# EAGLE schematic tirasRGB (EAGLE 6.5.0)
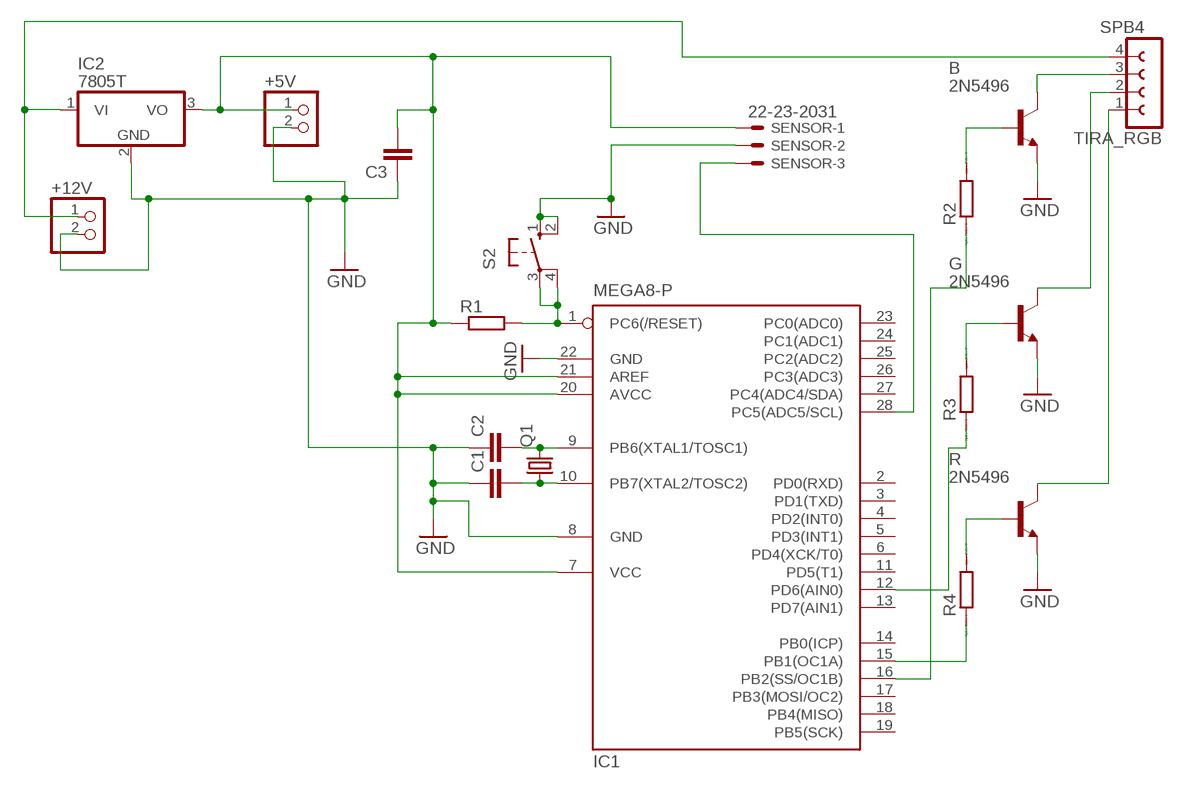
[diagram p0: schematic, sheet 1]

## Parts
+5V  PINHD-1X2  [1X02]
+12V  PINHD-1X2  [1X02]
B  2N5496  [TO220]
C1  C2,5-3  [C2.5-3]
C2  C2,5-3  [C2.5-3]
C3  C2,5-3  [C2.5-3]
G  2N5496  [TO220]
IC1  MEGA8-P  [DIL28-3]
IC2  7805T  [TO220H]
Q1  CRYSTALTC26V  [TC26V]
R  2N5496  [TO220]
R1  R-EU_0204/5  [0204/5]
R2  R0207/10  [0207/10]
R3  R0207/10  [0207/10]
R4  R0207/10  [0207/10]
S2  10-XX  [B3F-10XX]
SENSOR  22-23-2031  [22-23-2031]
TIRA_RGB  SPB4  [SPB4]

## Nets
3.3V: +5V.1 C3.2 IC1.7(VCC) IC1.20(AVCC) IC1.21(AREF) IC2.3(VO) R1.1 SENSOR.1
GND: +5V.2 +12V.2 B.3(E) C1.1 C2.1 C3.1 G.3(E) IC1.8(GND) IC1.22(GND) IC2.2(GND) R.3(E) S2.1(S) S2.2(S1) SENSOR.2
N$1: B.1(B) R2.2
N$2: +12V.1 IC2.1(VI) TIRA_RGB.4
N$3: G.1(B) R3.2
N$4: R4.2 R.1(B)
N$5: R.2(C) TIRA_RGB.1
N$6: G.2(C) TIRA_RGB.2
N$7: B.2(C) TIRA_RGB.3
N$8: IC1.15(PB1(OC1A)) R4.1
N$9: IC1.12(PD6(AIN0)) R3.1
N$10: IC1.16(PB2(SS/OC1B)) R2.1
N$12: IC1.28(PC5(ADC5/SCL)) SENSOR.3
N$14: C2.2 IC1.9(PB6(XTAL1/TOSC1)) Q1.2
N$15: C1.2 IC1.10(PB7(XTAL2/TOSC2)) Q1.1
N$16: IC1.1(PC6(/RESET)) R1.2 S2.3(P) S2.4(P1)
Unconnected: IC1.2(PD0(RXD)) IC1.3(PD1(TXD)) IC1.4(PD2(INT0)) IC1.5(PD3(INT1)) IC1.6(PD4(XCK/T0)) IC1.11(PD5(T1)) IC1.13(PD7(AIN1)) IC1.14(PB0(ICP)) IC1.17(PB3(MOSI/OC2)) IC1.18(PB4(MISO)) IC1.19(PB5(SCK)) IC1.23(PC0(ADC0)) IC1.24(PC1(ADC1)) IC1.25(PC2(ADC2)) IC1.26(PC3(ADC3)) IC1.27(PC4(ADC4/SDA))

## Library data of the parts
+5V +12V = pinhead:PINHD-1X2: PIN HEADER
B G R = transistor:2N5496: NPN TRANSISTOR
C1-C3 = capacitor-wima:C: CAPACITOR naming: grid - package width
IC1 = atmel:MEGA8-P: MICROCONTROLLER 8 Kbytes FLASH, 1 kbytes SRAM, 512 bytes EEPROM, USART, 4-channel 10 bit ADC, 2-channel 8 bit ADC Pin compatible with Atmega48, ATMega88, ATMega168 Source: avr.lbr; OC_FARNELL: unknown; OC_NEWARK: unknown
IC2 = linear:78*: Positive VOLTAGE REGULATOR Source: http://cache.national.com/ds/LM/LM78L05.pdf http://www.fairchildsemi.com/ds/LM/LM7805.pdf
Q1 = crystal:CRYSTAL: CRYSTAL; OC_FARNELL: unknown; OC_NEWARK: unknown
R1 = rcl:R-EU_: RESISTOR, European symbol
R2-R4 = eagle-ltspice:R: RESISTOR, European symbol; SPICEMODEL: NONE; SPICEPREFIX: R
S2 = switch-omron:10-XX: OMRON SWITCH; MPN: B3F-1000; OC_FARNELL: 176432; OC_NEWARK: 36M3542
SENSOR = con-molex:22-23-2031: .100" (2.54mm) Center Header - 3 Pin; MF: MOLEX; MPN: 22-23-2031; OC_FARNELL: 1462950; OC_NEWARK: 30C0862
TIRA_RGB = con-hirschmann:SPB4: CONNECTOR 4 pins; OC_FARNELL: unknown; OC_NEWARK: unknown